# EAGLE design utilidong-ftdi-uart-mk-1.0 (EAGLE 7.5.0)
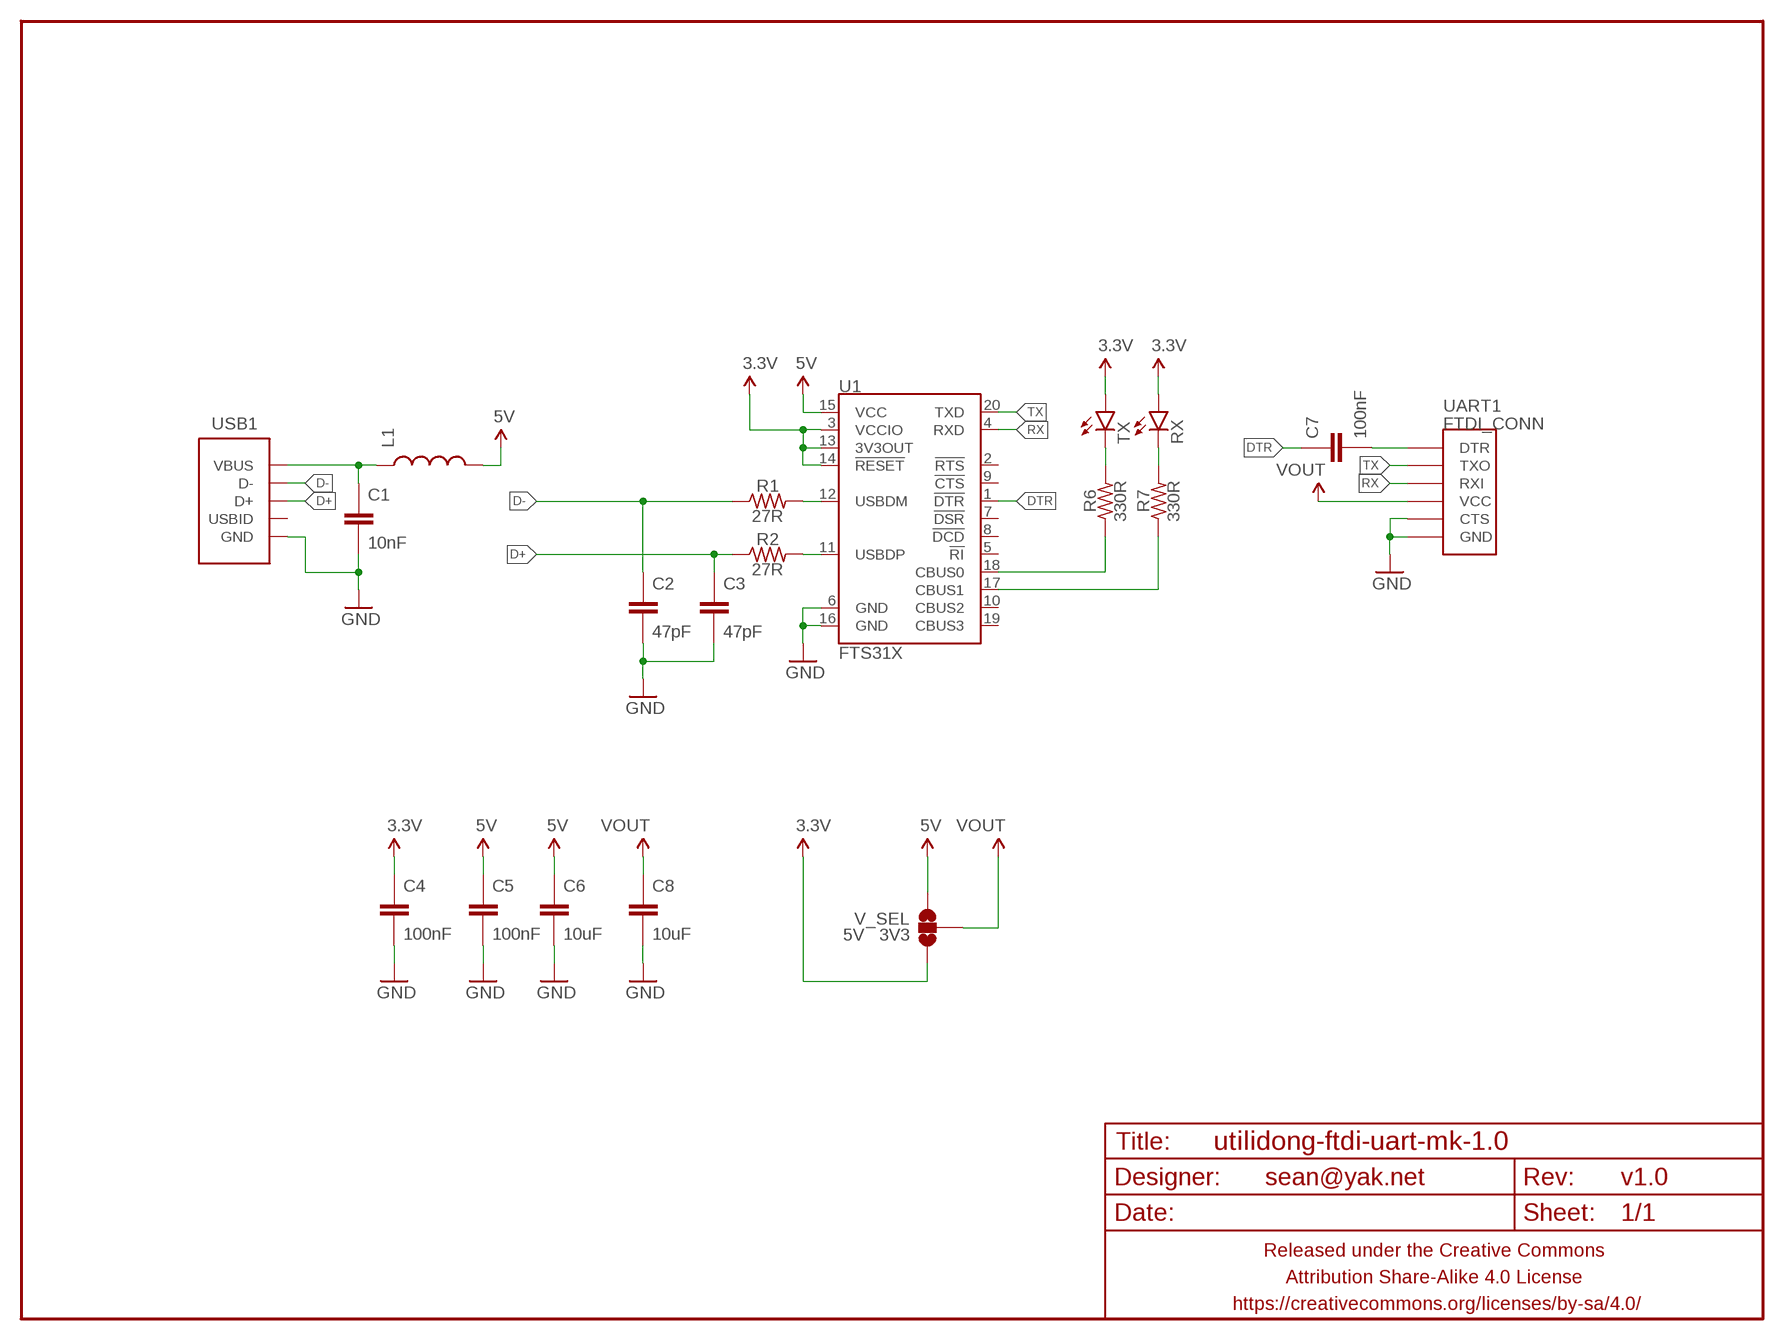
[diagram p0: schematic, sheet 1]

## Parts
C1  10nF  CAPACITOR-CERAMICC0805  [C0805]
C2  47pF  CAPACITOR-CERAMICC0805  [C0805]
C3  47pF  CAPACITOR-CERAMICC0805  [C0805]
C4  100nF  CAPACITOR-CERAMICC0805  [C0805]
C5  100nF  CAPACITOR-CERAMICC0805  [C0805]
C6  10uF  CAPACITOR-CERAMICC1206  [C1206]
C7  100nF  CAPACITOR-CERAMICC0805  [C0805]
C8  10uF  CAPACITOR-CERAMICC1206  [C1206]
FRAME1  FRAME-LETTERNO_PACKAGE  [DUMMY]
L1  INDUCTORL0805  [L0805]
R1  27R  RESISTORR0805  [R0805]
R2  27R  RESISTORR0805  [R0805]
R6  330R  RESISTORR0805  [R0805]
R7  330R  RESISTORR0805  [R0805]
RX  LED1206  [LED-1206]
TX  LED1206  [LED-1206]
U1  FTS31X  FT231XS  [SSOP20_L]
UART1  FTDI_CONN  [FTDI_CONN]
USB1  USB-ABCOMBO  [USB-MICRO-B-FCI-CUTOUT]
V_SEL  5V 3V3  JUMPER-PAD-3-NOFULL_BOX_SILK  [PAD-JUMPER-3-NO_YES_SILK_FULL_BOX]

## Nets
3.3V: C4.1 RX.A TX.A U1.3(VCCIO) U1.13(3V3OUT) U1.14(!RESET) V_SEL.3
5V: C5.1 C6.1 L1.2 U1.15(VCC) V_SEL.1
D+: C3.1 R2.1 USB1.3(D+)
D-: C2.1 R1.1 USB1.2(D-)
DTR: C7.1 U1.1(!DTR)
GND: C1.2 C2.2 C3.2 C4.2 C5.2 C6.2 C8.2 U1.6(GND) U1.16(GND) UART1.CTS UART1.GND USB1.5(GND) USB1.P$1(GND) USB1.P$2(GND)
N$1: R1.2 U1.12(USBDM)
N$2: R2.2 U1.11(USBDP)
N$3: C1.1 L1.1 USB1.1(VBUS)
N$4: C7.2 UART1.DTR
N$7: R6.1 U1.18(CBUS0)
N$9: R6.2 TX.C
N$10: R7.2 RX.C
N$12: R7.1 U1.17(CBUS1)
RX: U1.4(RXD) UART1.RXI
TX: U1.20(TXD) UART1.TXO
VOUT: C8.1 UART1.VCC V_SEL.2
Unconnected: U1.2(!RTS) U1.5(!RI) U1.7(!DSR) U1.8(!DCD) U1.9(!CTS) U1.10(CBUS2) U1.19(CBUS3) USB1.4(USBID)

## Library data of the parts
C1-C8 = A_butts:CAPACITOR-CERAMIC: CAPACITOR, European symbol
FRAME1 = A_butts:FRAME-LETTER: Schematic Frame Standard 8.5x11 US Letter frame; DESIGNER: sean@yak.net; VERSION: v1.0
L1 = A_butts:INDUCTOR: Inductors Basic Inductor/Choke - 0603 and 1206. Footprints are not proven and vary greatly between part numbers. SRN6045- 33uH, 20% 1.4A SDR0403-560KL - 56uH, 10%, 500mA RMS/740mA peak
R1 R2 R6 R7 = A_butts:RESISTOR: RESISTOR, American symbol
RX TX = A_butts:LED: LEDs Standard schematic elements and footprints for 5mm, 3mm, 1206, and 0603 sized LEDs. 5mm - Spark Fun Electronics SKU : COM-00529 (and others)
U1 = A_butts:FT231X: FTDI FT231X Full Speed USB to Full-handshake UART This USB2.0 Full Speed IC offers a compact bridge to full handshake UART interfaces. The device is a UART, capable of operating up to 3MBaud, with low power consumption (8mA). The FT231X includes the complete FT-X series feature set and enables USB to be added into a system design quickly and easily over a UART interface.; PROD_ID: IC-11524; VALUE: FTS31XS-U
UART1 = A_butts:FTDI_CONN: Connector which mates to FTDI basic or FTDI cable.
USB1 = A_butts:USB-AB: This is a USB AB connector that is compatible with USB OTG. i.e. this connector can serve as a host or device
V_SEL = A_butts:JUMPER-PAD-3-NO

## Board
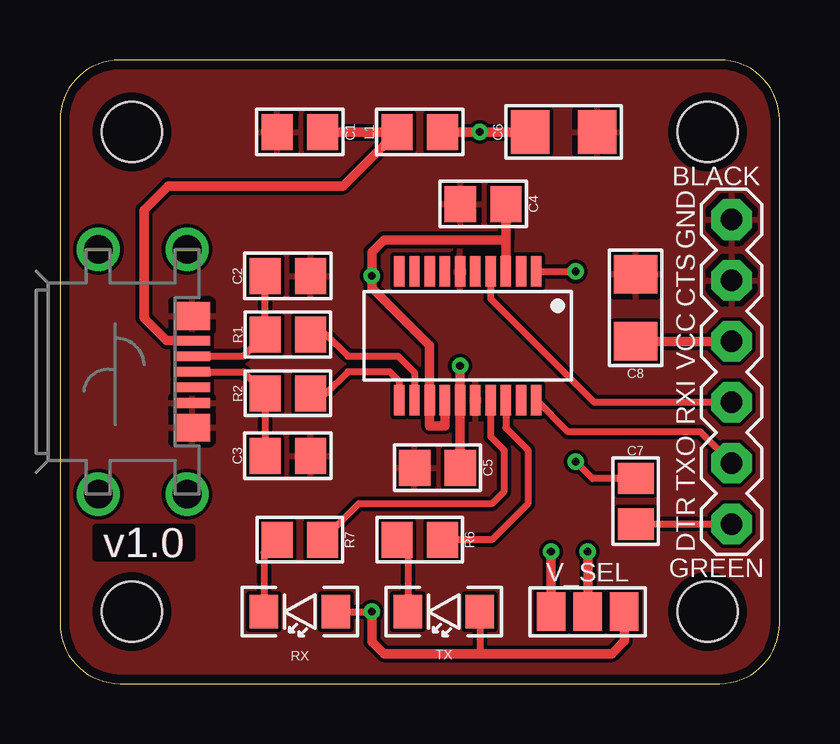
[diagram p1: board, top side]
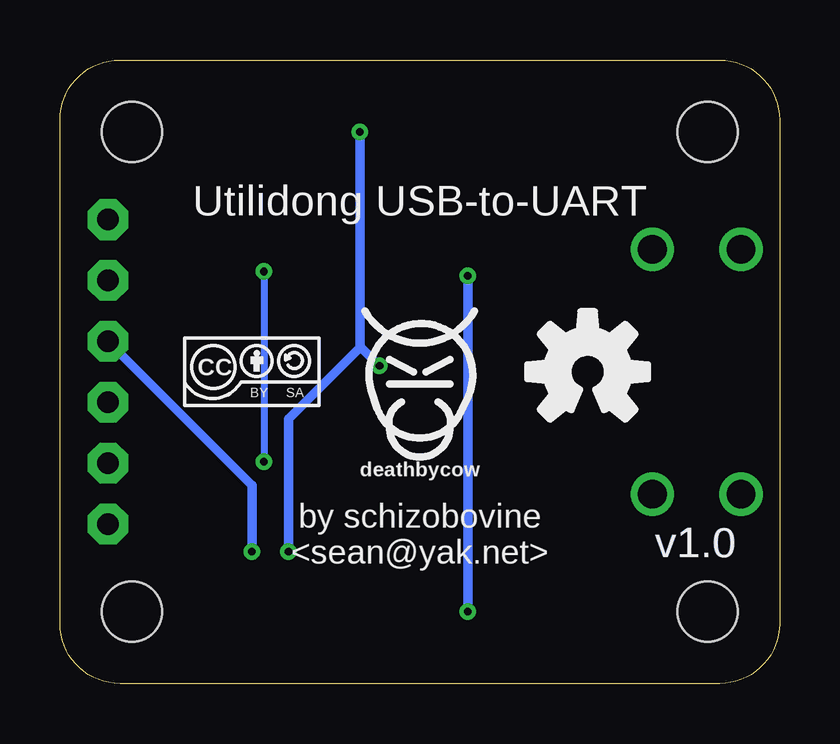
[diagram p2: board, bottom side, seen from below]

Size 30 x 26 mm. Coordinates in mm from the lower left corner, seen from the top.
Outline: 0,23.5 0,2.5 arc90 2.5,0 27.5,0 arc90 30,2.5 30,23.5 arc90 27.5,26 2.5,26 arc90 0,23.5
Copper layers (1*16): Top 0.0356mm / dielectric 1.5011mm / Bottom 0.0356mm
Design rules "LaenPCBOrder_2": minimum track width 6mil, minimum drill 13mil, track to track 6mil, track to pad 6mil, pad to pad 6mil, via to via 6mil, smd to smd 6mil, copper to edge 15mil, drill to drill 6mil, minimum pad ring 7mil, minimum via ring 7mil, stop-mask expansion 3mil, vias tented up to drill 20mil, thermal gap 10mil
Holes 2.5 mm at 3,23 3,3 27,3 27,23

### Footprints (pad centres in the part's own frame; a part is rotated, then mirrored left to right if it is on the bottom)
C0805 = smd 1.3 x 1.5: 1 -0.95,0; 2 0.95,0
C1206 = smd 1.6 x 1.8: 1 -1.4,0; 2 1.4,0
L0805 = smd 1.3 x 1.5: 1 -0.95,0; 2 0.95,0
R0805 = smd 1.3 x 1.5: 1 -0.95,0; 2 0.95,0
LED-1206 = smd 1.2 x 1.4: A -1.5,0; C 1.5,0
SSOP20_L = smd 0.43 x 1.27: 1 -2.857,-2.68; 2 -2.223,-2.68; 3 -1.587,-2.68; 4 -0.953,-2.68; 5 -0.318,-2.68; 6 0.318,-2.68; 7 0.953,-2.68; 8 1.587,-2.68; 9 2.223,-2.68; 10 2.857,-2.68; 11 2.857,2.68; 12 2.223,2.68; 13 1.587,2.68; 14 0.953,2.68; 15 0.318,2.68; 16 -0.318,2.68; 17 -0.953,2.68; 18 -1.587,2.68; 19 -2.223,2.68; 20 -2.857,2.68
FTDI_CONN = drill 0.9 pad 1.7 octagon: CTS 3.81,0; DTR -6.35,0; GND 6.35,0; RXI -1.27,0; TXO -3.81,0; VCC 1.27,0
USB-MICRO-B-FCI-CUTOUT = smd 0.4 x 1.5: 1 -1.3,0; 2 -0.65,0; 3 0,0; 4 0.65,0; 5 1.3,0 | smd 1.15 x 1.5: P$1 -2.325,0; P$2 2.325,0 | drill 1.2: P$3 -5.1,-0.2; P$4 5.1,-0.2; P$5 -5.1,-3.9; P$6 5.1,-3.9
PAD-JUMPER-3-NO_YES_SILK_FULL_BOX = smd 1.2 x 1.6: 1 -1.524,0; 2 0,0; 3 1.524,0

### Placement (x,y rotation side)
C1  10,23 180 top
C2  9.5,17 0 top
C3  9.5,9.5 0 top
C4  17.64,20 180 top
C5  15.74,9 180 top
C6  21,23 0 top
C7  24,7.6 270 top
C8  24,15.67 90 top
FRAME1  0,0 0 top
L1  15,23 0 top
R1  9.5,14.55 0 top
R2  9.5,12.1 0 top
R6  15,6 180 top
R7  10,6 180 top
RX  10,3 180 top
TX  16,3 180 top
U1  17,14.5 180 top
U$3  [COW_SMALL]  15,13 0 bottom
U$4  [CC-BY-SA-4.0-NO-URL]  22,13 0 bottom
U$6  [OSHWLOGO_TOP_0.2_A]  8,13 0 bottom
UART1  28,13 90 top
USB1  5.5,13 270 top
V_SEL  22,3 0 top

### Tracks (layer width: path | path; a pad name or v marks a point on that pad's centre or on a via)
3.3V  (via drill 0.33)
  Top 0.3: TX.A 17.5,1.25 | RX.A v13,3
  Top 0.4: U1.14 16.05,10.75 15.41,10.75 U1.13 15.41,14.09 13,16.5 v13,17 13,18 13.5,18.5 18.59,18.5 | U1.3 18.59,18.5 | C4.1 18.59,18.5 | v13,3 13,1.75 13.5,1.25 17.5,1.25 23,1.25 23.52,1.77 V_SEL.3
  Bottom 0.4: v13,3 v13,17
5V  (via drill 0.33)
  Top 0.4: L1.2 v17.5,23 C6.1 | C5.1 16.68,9.51 U1.15 v16.68,13.25 | v20.48,5.5 V_SEL.1
  Bottom 0.4: v16.68,13.25 17.47,14.03 | 17.47,14.03 17.5,14.07 v17.5,23 | 17.47,14.03 20.48,11.02 v20.48,5.5
D+
  Top 0.3: USB1.3 7.65,13 R2.1 C3.1
D-
  Top 0.3: USB1.2 7.65,13.65 R1.1 C2.1
DTR  (via drill 0.33)
  Top 0.3: U1.1 v21.5,17.18 | C7.1 22.2,8.55 v21.5,9.25
  Bottom 0.3: v21.5,17.18 v21.5,9.25
GND
  pour Top: -0.1,-0.1 -0.1,26.1 30.1,26.1 30.1,-0.1
N$1
  Top 0.3: R1.2 11.1,14.55 12,13.65 14.1,13.65 14.78,12.97 U1.12
N$2
  Top 0.3: R2.2 11.1,12.1 12,13 13.75,13 14.14,12.61 U1.11
N$3
  Top 0.4: USB1.1 4.45,14.3 3.5,15.25 3.5,19.75 4.5,20.75 11.8,20.75 L1.1 C1.1
N$4
  Top 0.3: C7.2 UART1.DTR
N$7
  Top 0.3: U1.18 18.59,10.66 19.5,9.75 19.5,7.5 18,6 R6.1
N$9
  Top 0.3: R6.2 14.5,5.55 TX.C
N$10
  Top 0.3: R7.2 8.5,5.45 RX.C
N$12
  Top 0.3: U1.17 17.95,10.3 18.5,9.75 18.5,8 18,7.5 12.45,7.5 R7.1
RX
  Top 0.3: U1.4 17.95,16.05 22.27,11.73 UART1.RXI
TX
  Top 0.3: UART1.TXO 26.69,10.5 21.18,10.5 U1.20
VOUT  (via drill 0.33)
  Top 0.4: v22,5.5 V_SEL.2 | C8.1 UART1.VCC
  Bottom 0.4: v22,5.5 22,8.27 UART1.VCC

### Text on the board
bPlace: Utilidong USB-to-UART | by schizobovine / <sean@yak.net>